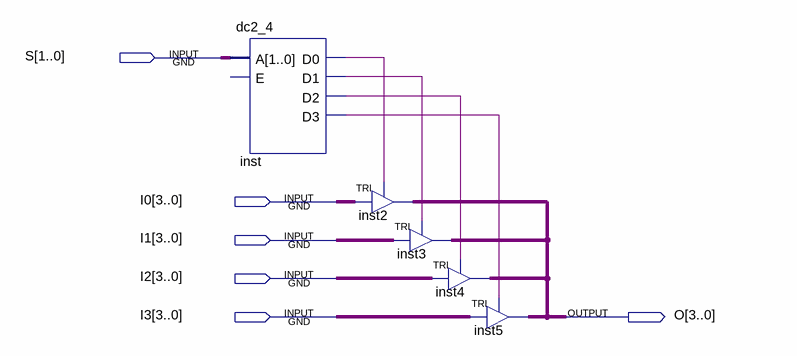
[diagram p0: schematic sheet]
// Quartus schematic mx4_4b.bdf as structural Verilog: 5 symbols, 6 pins
module mx4_4b (
  input  [1:0] S,
  input  [3:0] I0,
  input  [3:0] I1,
  input  [3:0] I2,
  input  [3:0] I3,
  output [3:0] O
);

  wire inst_d0, inst_d1, inst_d2, inst_d3;

  dc2_4 inst (.A(S), .D0(inst_d0), .D1(inst_d1), .D2(inst_d2), .D3(inst_d3));  // open: E
  TRI inst2[3:0] (.IN(I0), .OE(inst_d0), .OUT(O));
  TRI inst3[3:0] (.IN(I1), .OE(inst_d1), .OUT(O));
  TRI inst4[3:0] (.IN(I2), .OE(inst_d2), .OUT(O));
  TRI inst5[3:0] (.IN(I3), .OE(inst_d3), .OUT(O));
endmodule
